# EAGLE design pi0 (EAGLE 6.6.0)
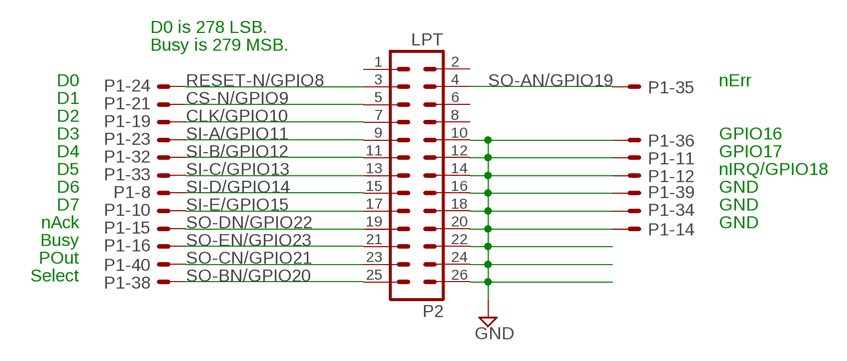
[diagram p0: schematic, sheet 1]

## Parts
P1  RasPi  ML40E  [ML40]
P2  LPT  MA13-2  [MA13-2]

## Nets
CLK/GPIO10: P1.19 P2.7
CS-N/GPIO9: P1.21 P2.5
GND [Supply]: P1.11 P1.12 P1.14 P1.34 P1.36 P1.39 P2.10 P2.12 P2.14 P2.16 P2.18 P2.20 P2.22 P2.24 P2.26
RESET-N/GPIO8: P1.24 P2.3
SI-A/GPIO11: P1.23 P2.9
SI-B/GPIO12: P1.32 P2.11
SI-C/GPIO13: P1.33 P2.13
SI-D/GPIO14: P1.8 P2.15
SI-E/GPIO15: P1.10 P2.17
SO-AN/GPIO19: P1.35 P2.4
SO-BN/GPIO20: P1.38 P2.25
SO-CN/GPIO21: P1.40 P2.23
SO-DN/GPIO22: P1.15 P2.19
SO-EN/GPIO23: P1.16 P2.21
Unconnected: P1.1 P1.2 P1.3 P1.4 P1.5 P1.6 P1.7 P1.9 P1.13 P1.17 P1.18 P1.20 P1.22 P1.25 P1.26 P1.27 P1.28 P1.29 P1.30 P1.31 P1.37 P2.1 P2.2 P2.6 P2.8

## Notes on the sheet
- D0 is 278 LSB.
- Busy is 279 MSB.
- D0 | nErr
- D1
- D2
- D3 | GPIO16
- D4 | GPIO17
- D5 | nIRQ/GPIO18
- D6 | GND
- D7 | GND
- nAck | GND
- Busy
- POut
- Select

## Library data of the parts
P1 = con-harting-ml:ML40?E: HARTING; OC_FARNELL: unknown; OC_NEWARK: unknown
P2 = con-lstb:MA13-2: PIN HEADER; OC_FARNELL: unknown; OC_NEWARK: unknown

## Net classes
1 Supply: width 0.813 mm

## Board
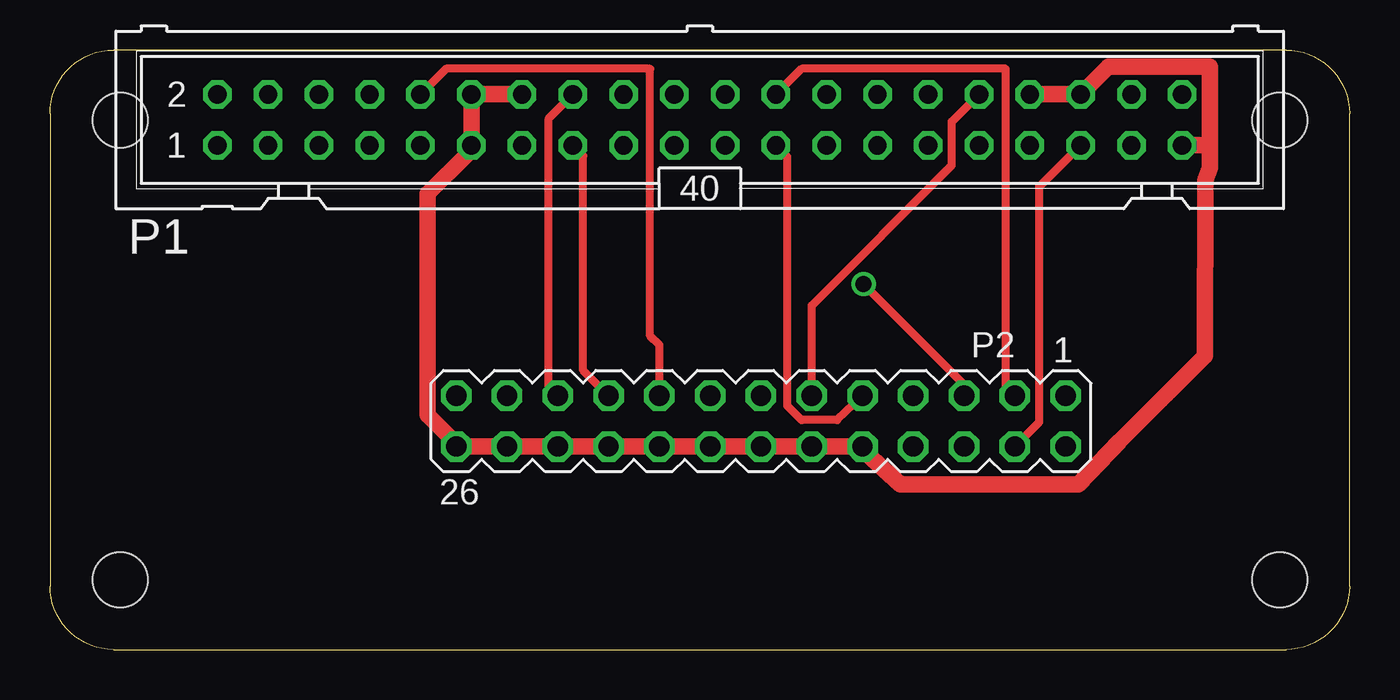
[diagram p1: board, top side]
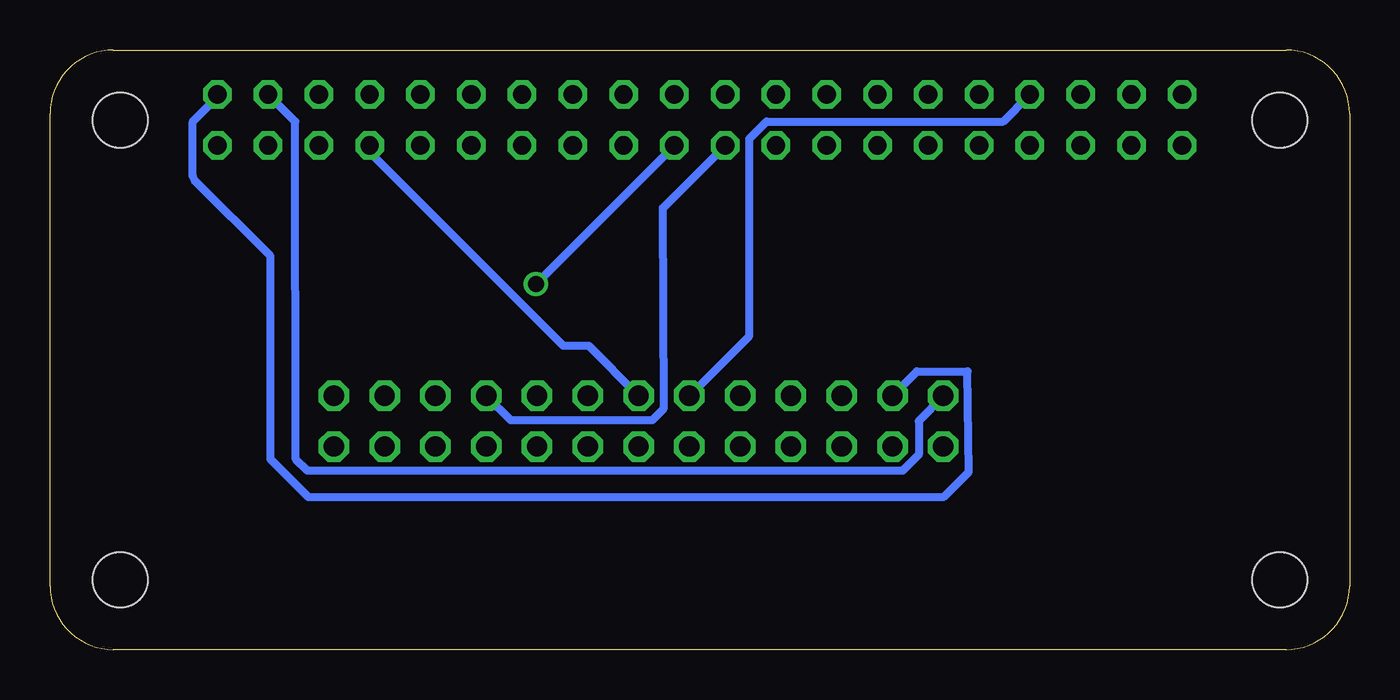
[diagram p2: board, bottom side, seen from below]

Size 65 x 30 mm. Coordinates in mm from the lower left corner, seen from the top.
Outline: 0,26.82 0,3.17 arc90 3.17,0 61.83,0 arc90 65,3.17 65,26.82 arc90 61.83,30 3.17,30 arc90 0,26.82
Copper layers (1+16): Top 0.035mm / dielectric 1.5mm / Bottom 0.035mm
Design rules "16mils": minimum track width 16mil, minimum drill 32mil, track to track 15mil, track to pad 10mil, pad to pad 10mil, via to via 10mil, smd to smd 10mil, copper to edge 13mil, drill to drill 10mil, minimum pad ring 10mil, minimum via ring 8mil, stop-mask expansion 0mil, vias tented up to drill 0mil, thermal gap 10mil
Holes 2.75 mm at 3.5,3.5 3.5,26.5 61.5,26.5 61.5,3.5
tKeepout: area 0.5,0.5 to 6.5,6.5; area 0.5,23.5 to 6.5,29.5; area 58.5,23.5 to 64.5,29.5; area 58.5,0.5 to 64.5,6.5
vRestrict: area 6.3,22.9 to 58.4,29.2

### Footprints (pad centres in the part's own frame; a part is rotated, then mirrored left to right if it is on the bottom)
ML40 = drill 0.914 octagon: 1 -24.13,-1.27; 2 -24.13,1.27; 3 -21.59,-1.27; 4 -21.59,1.27; 5 -19.05,-1.27; 6 -19.05,1.27; 7 -16.51,-1.27; 8 -16.51,1.27; 9 -13.97,-1.27; 10 -13.97,1.27; 11 -11.43,-1.27; 12 -11.43,1.27; 13 -8.89,-1.27; 14 -8.89,1.27; 15 -6.35,-1.27; 16 -6.35,1.27; 17 -3.81,-1.27; 18 -3.81,1.27; 19 -1.27,-1.27; 20 -1.27,1.27; 21 1.27,-1.27; 22 1.27,1.27; 23 3.81,-1.27; 24 3.81,1.27; 25 6.35,-1.27; 26 6.35,1.27; 27 8.89,-1.27; 28 8.89,1.27; 29 11.43,-1.27; 30 11.43,1.27; 31 13.97,-1.27; 32 13.97,1.27; 33 16.51,-1.27; 34 16.51,1.27; 35 19.05,-1.27; 36 19.05,1.27; 37 21.59,-1.27; 38 21.59,1.27; 39 24.13,-1.27; 40 24.13,1.27
MA13-2 = drill 1.016 octagon: 1 -15.24,-1.27; 2 -15.24,1.27; 3 -12.7,-1.27; 4 -12.7,1.27; 5 -10.16,-1.27; 6 -10.16,1.27; 7 -7.62,-1.27; 8 -7.62,1.27; 9 -5.08,-1.27; 10 -5.08,1.27; 11 -2.54,-1.27; 12 -2.54,1.27; 13 0,-1.27; 14 0,1.27; 15 2.54,-1.27; 16 2.54,1.27; 17 5.08,-1.27; 18 5.08,1.27; 19 7.62,-1.27; 20 7.62,1.27; 21 10.16,-1.27; 22 10.16,1.27; 23 12.7,-1.27; 24 12.7,1.27; 25 15.24,-1.27; 26 15.24,1.27

### Placement (x,y rotation side)
P1  32.5,26.5 0 top
P2  35.56,11.43 180 top

### Tracks (layer width: path | path; a pad name or v marks a point on that pad's centre or on a via)
CLK/GPIO10
  Bottom 0.406: P2.7 41.96,11.48 34.87,11.48 34.29,12.06 34.34,22.1 31.24,25.2 P1.19
CS-N/GPIO9  (via drill 0.81)
  Top 0.406: v40.69,18.29 45.72,13.26 P2.5
  Bottom 0.406: v40.69,18.29 33.78,25.2 P1.21
GND
  Top 0.813: 58.01,25.25 58.01,24.08 57.78,23.5 57.76,14.68 53.49,10.41 51.44,8.26 42.55,8.26 40.84,9.8 P2.10 P2.12 P2.14 P2.16 P2.18 P2.20 P2.22 P2.24 P2.26 20.12,10.52 18.9,11.73 18.9,22.81 20.93,24.84 P1.11 21.08,25.25 21.08,27.74 P1.12 21.49,27.79 23.57,27.79 P1.14 | 58.01,25.25 58.01,29.16 52.93,29.16 51.56,27.79 P1.36 51.16,27.79 49.02,27.79 P1.34 | 58.01,25.25 56.64,25.25 P1.39
RESET-N/GPIO8
  Top 0.406: P2.3 47.8,13.16 47.8,29.06 37.59,29.06 36.32,27.79 P1.24
SI-A/GPIO11
  Top 0.406: P2.9 39.37,11.48 37.59,11.48 36.88,12.19 36.88,24.64 36.32,25.2 P1.23
SI-B/GPIO12
  Top 0.406: P2.11 38.1,17.22 45.11,24.23 45.11,26.42 46.43,27.74 P1.32
SI-C/GPIO13
  Bottom 0.406: P2.13 38.05,15.19 39.32,15.19 48.9,24.77 P1.33
SI-D/GPIO14
  Bottom 0.406: P2.15 30.02,15.7 30.02,25.55 29.16,26.42 17.32,26.42 16,27.74 P1.8
SI-E/GPIO15
  Top 0.406: P2.17 30.48,15.24 30.02,15.7 30.02,29.06 19.81,29.06 18.54,27.79 P1.10
SO-AN/GPIO19
  Top 0.406: P2.4 49.48,11.38 49.48,23.16 51.51,25.2 P1.35
SO-BN/GPIO20
  Bottom 0.406: P2.25 21.54,11.43 21.54,9.75 22.35,8.94 52.12,8.94 52.7,9.53 52.73,26.42 54.05,27.74 P1.38
SO-CN/GPIO21
  Bottom 0.406: P2.23 21.64,13.92 19.1,13.92 19.05,8.89 20.32,7.62 52.07,7.62 53.98,9.53 53.98,19.68 57.78,23.5 57.86,23.67 57.86,26.42 56.69,27.58 P1.40
SO-DN/GPIO22
  Top 0.406: P2.19 26.67,13.97 26.67,24.69 26.16,25.2 P1.15
SO-EN/GPIO23
  Top 0.406: P2.21 24.94,13.16 24.94,26.57 26.11,27.74 P1.16